# EAGLE design Breathing termo (EAGLE 9.6.2)
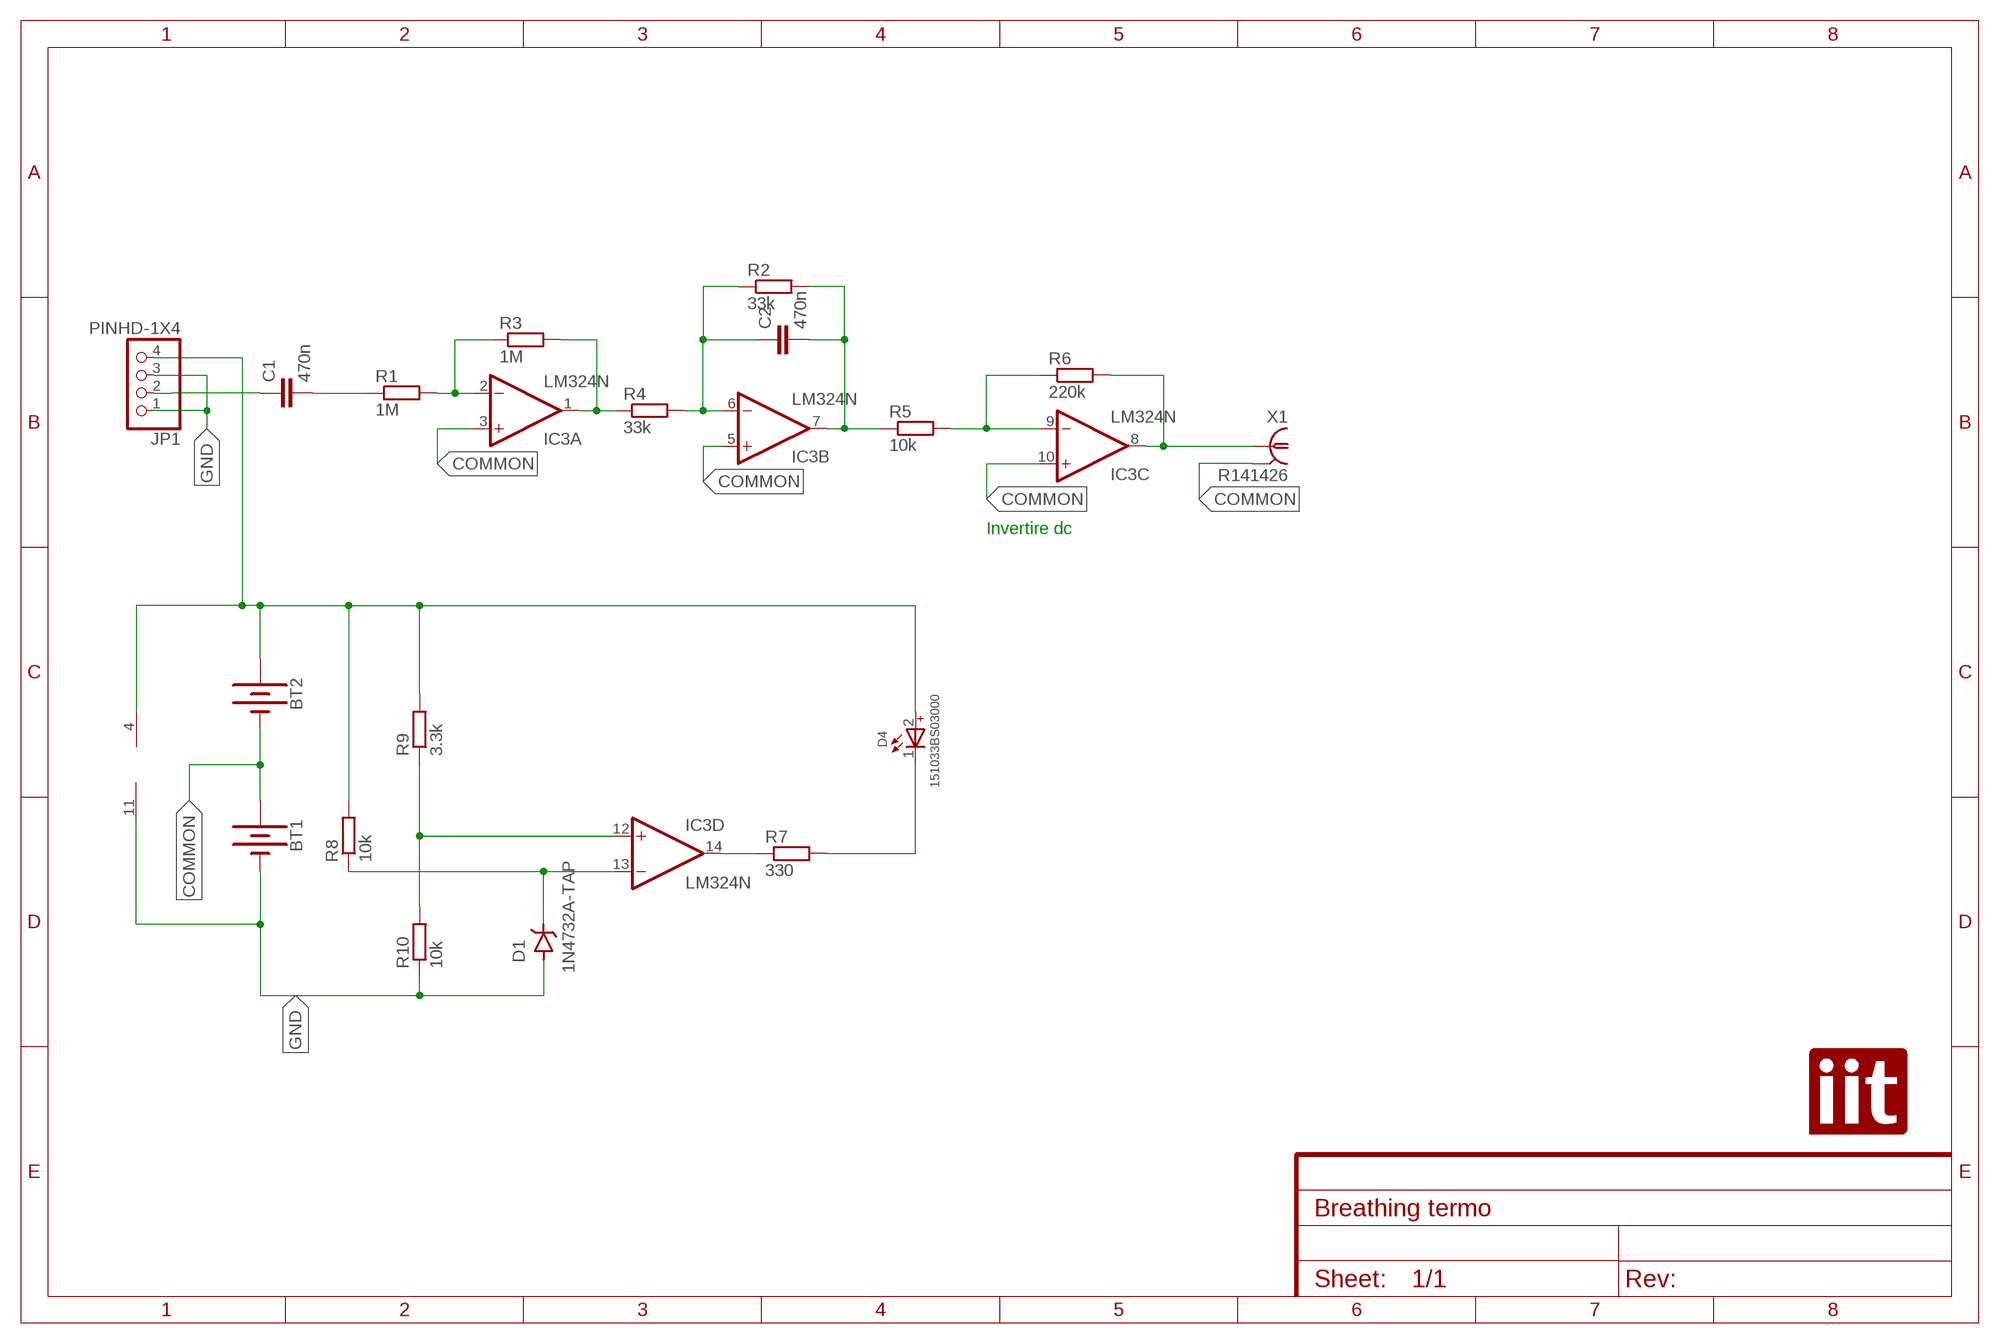
[diagram p0: schematic, sheet 1]

## Parts
BT1  BATTERY-9V  [BATTCON_9V]
BT2  BATTERY-9V  [BATTCON_9V]
C1  470n  C-EU025-025X050  [C025-025X050]
C2  470n  C-EU025-025X050  [C025-025X050]
D1  1N4732A-TAP  [DO-41]
D4  151033BS03000  WL-TMRW_3MM_151033BS03000_WITHSTOPPER  [WL-TMRW_3MM_STOPPER]
IC3  LM324N  [DIL14]
JP1  PINHD-1X4  [1X04]
R1  1M  R-EU_0204/7  [0204/7]
R2  33k  R-EU_0204/7  [0204/7]
R3  1M  R-EU_0204/7  [0204/7]
R4  33k  R-EU_0204/7  [0204/7]
R5  10k  R-EU_0204/7  [0204/7]
R6  220k  R-EU_0204/7  [0204/7]
R7  330  R-EU_0204/7  [0204/7]
R8  10k  R-EU_0204/7  [0204/7]
R9  3.3k  R-EU_0204/7  [0204/7]
R10  10k  R-EU_0204/7  [0204/7]
U$1  LOGO  [IIT]
X1  R141426  [R141426]

## Nets
COMMON: BT1.+ BT2.- IC3.3(A:+IN) IC3.5(B:+IN) IC3.10(C:+IN) X1.2 X1.3 X1.4 X1.5
GND: BT1.- D1.A IC3.11(P:V-) JP1.1 JP1.3 R10.1
N$1: C1.2 R1.1
N$2: IC3.2(A:-IN) R1.2 R3.1
N$3: IC3.1(A:OUT) R3.2 R4.1
N$4: C2.1 IC3.6(B:-IN) R2.1 R4.2
N$5: C2.2 IC3.7(B:OUT) R2.2 R5.1
N$6: IC3.9(C:-IN) R5.2 R6.1
N$7: IC3.8(C:OUT) R6.2 X1.1
N$8: IC3.12(D:+IN) R9.1 R10.2
N$9: D4.1(-) R7.2
N$10: D1.C IC3.13(D:-IN) R8.1
N$11: C1.1 JP1.2
N$12: IC3.14(D:OUT) R7.1
N$14: BT2.+ D4.2(+) IC3.4(P:V+) JP1.4 R8.2 R9.2

## Notes on the sheet
- Invertire dc

## Library data of the parts
BT1 BT2 = SparkFun-Batteries:BATTERY: Battery - Single Cell A variety of battery chemistries, sizes, and footprints. Device List: 20MM_PTH - Coin Cell Battery Holder - 20mm (PTH) <https://www.sparkfun.com/products/783> 6.8MM_PTH - Coin Cell Battery Holder - 6.8MM(SMD) <https://www.digikey.com/product-detail/en/seiko-instruments/MS621FE-FL11E/728-1057-ND/1889208?WT.srch=1&gclid=CNOQ5a6LzdQCFZS2wAodXCkE0g> 12MM_SMD - Coin Cell Battery Holder - 12mm (SMD) <https://www.sparkfun.com/products/10592> 12MM_PTH - Coin Cell Battery Holder - 12mm (PTH) <https://www.sparkfun.com/products/7948> 20MM_SMD - 20mm Coin Cell Battery Holder (SMD) (2 legs) Used on the Big Time Watch Kit <https://www.sparkfun.com/products/11734> 20MM_SMD_4LEGS - Coin Cell Battery Holder - 20mm (SMD) <https://www.sparkfun.com/products/11892> 20MM_SMD_4LEGS_OVERPASTE - Coin Cell Battery Holder - 20mm (SMD) <https://www.sparkfun.com/products/11892> (Over-paste on the legs) 24.5MM_PTH - Coin Cell Battery Holder - 24.5mm (PTH) <https://www.sparkfun.com/products/8863> 9V - 9V Battery Holder - PC Mount Used on the SparkFun SparkPunk Sound Kit <https://www.sparkfun.com/products/11177> and SparkFun SparkPunk Sequencer Kit <https://www.sparkfun.com/products/12707> 18650 - Battery Holder - 18650 (PTH) <https://www.sparkfun.com/products/13113> AA - Battery Holder - 1xAA (PTH) <https://www.sparkfun.com/products/7949> AAA - Battery Holder - 1xAAA (PTH) <https://www.sparkfun.com/products/12718> AA_KIT - Battery Holder - 1xAA (PTH) <https://www.sparkfun.com/products/7949> Special kit package - pads only have exposed copper on one side of the board. AAA_KIT - Battery Holder - 1xAAA (PTH) <https://www.sparkfun.com/products/12718> Special kit package - pads only have exposed copper on one side of the board.; PROD_ID: BATT-10855
C1 C2 = rcl:C-EU: CAPACITOR, European symbol; SPICEPREFIX: C
D1 = Diodes-2:1N4732A-TAP: DIODE ZENER 4.7V 1.3W DO41 Manufacturer's datasheet <https://www.vishay.com/docs/85816/1n4728a.pdf>; CREATED_BY: PCBLayout.com; DIGIKEY_PART_NUMBER: 1N4732A-TAPGICT-ND; MANUFACTURER: Vishay General Semiconductor - Diodes Division; MPN: 1N4732A-TAP; PACKAGE: DO-41
D4 = Wurth_LEDs_WL-TMRW:WL-TMRW_3MM: WL-TMRW THT Mono-color Round Waterclear Characteristics Low energy consumption High reliability Low current requirement Fast switching No UV/IR radiation Easy installation Ultra high luminous efficacy Versatile mounting on PC boards With and without stopper Applications Indicator light Displays Traffic signal light Marker lights Commercial outdoor advertising Energy saving lamp Backlight LED Displays Electronic and optical indicator PBC mounted panel indicator Variable message sign <https://www.we-online.com/catalog/media/o14911v209%20Family_TMRW_THT.jpg> Details see: www.we-online.com/catalog/en/WL-TMRW <www.we-online.com/catalog/WL-TMRW/?utm_source=eagle_model&utm_medium=description_link&utm_campaign=eisos_eagle> Updated by Ella 2022-06-21 2022(C) Wurth Elektronik; CHIP-TECHNOLOGY: InGaN; DATASHEET-URL: https://www.we-online.com/redexpert/spec/151033BS03000?ae; DOMINANT-WAVELENGTH: 470nm; EMITTING-COLOR: Blue; FORWARD-VOLTAGE: 2.8V; LUMINOUS-INTENSITY: 3800mcd; PART-NUMBER: 151033BS03000; PEAK-WAVELENGTH: 465nm; VIEWING-ANGLE: 30°
IC3 = linear:LM324: OP AMP
JP1 = Connector:PINHD-1X4: PIN HEADER; CATEGORY: Headers; DESCRIPTION: Header, Straight, 4 Position; MANUFACTURER: Generic; MPN: Generic; OPERATING_TEMPERATURE: Generic; PART_STATUS: Active; PITCH: 0.100" (2.54mm); ROHS_COMPLIANCE: Generic; SERIES: Generic; SUB-CATEGORY: Headers, Male Pins; TYPE: Board to Board or Cable, Unshrouded, Through Hole, Straight
R1-R10 = resistor:R-EU_: RESISTOR, European symbol
U$1 = LOGO:LOGO
X1 = con-coax:R141426: BNC COAX CONNECTOR Radiall 50/75 Ohm Spoerle; MF: FARNELL; MPN: R141426161; OC_FARNELL: 4195115; OC_NEWARK: 14J7919

## Board
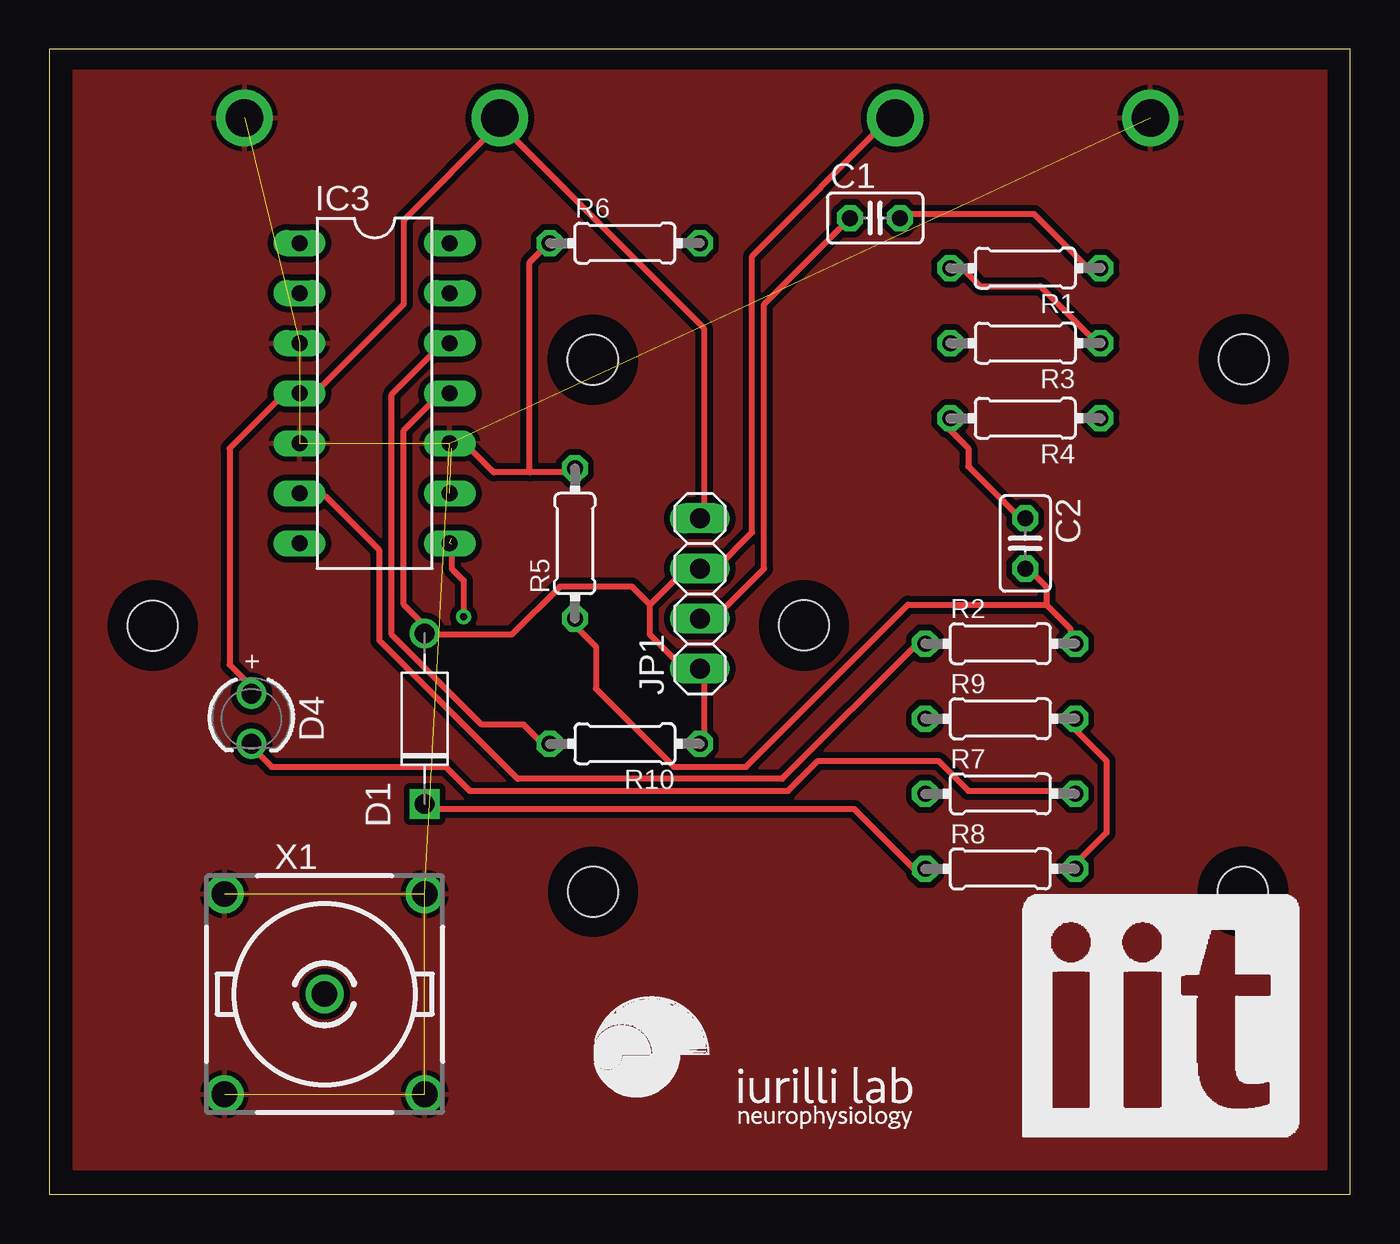
[diagram p1: board, top side]
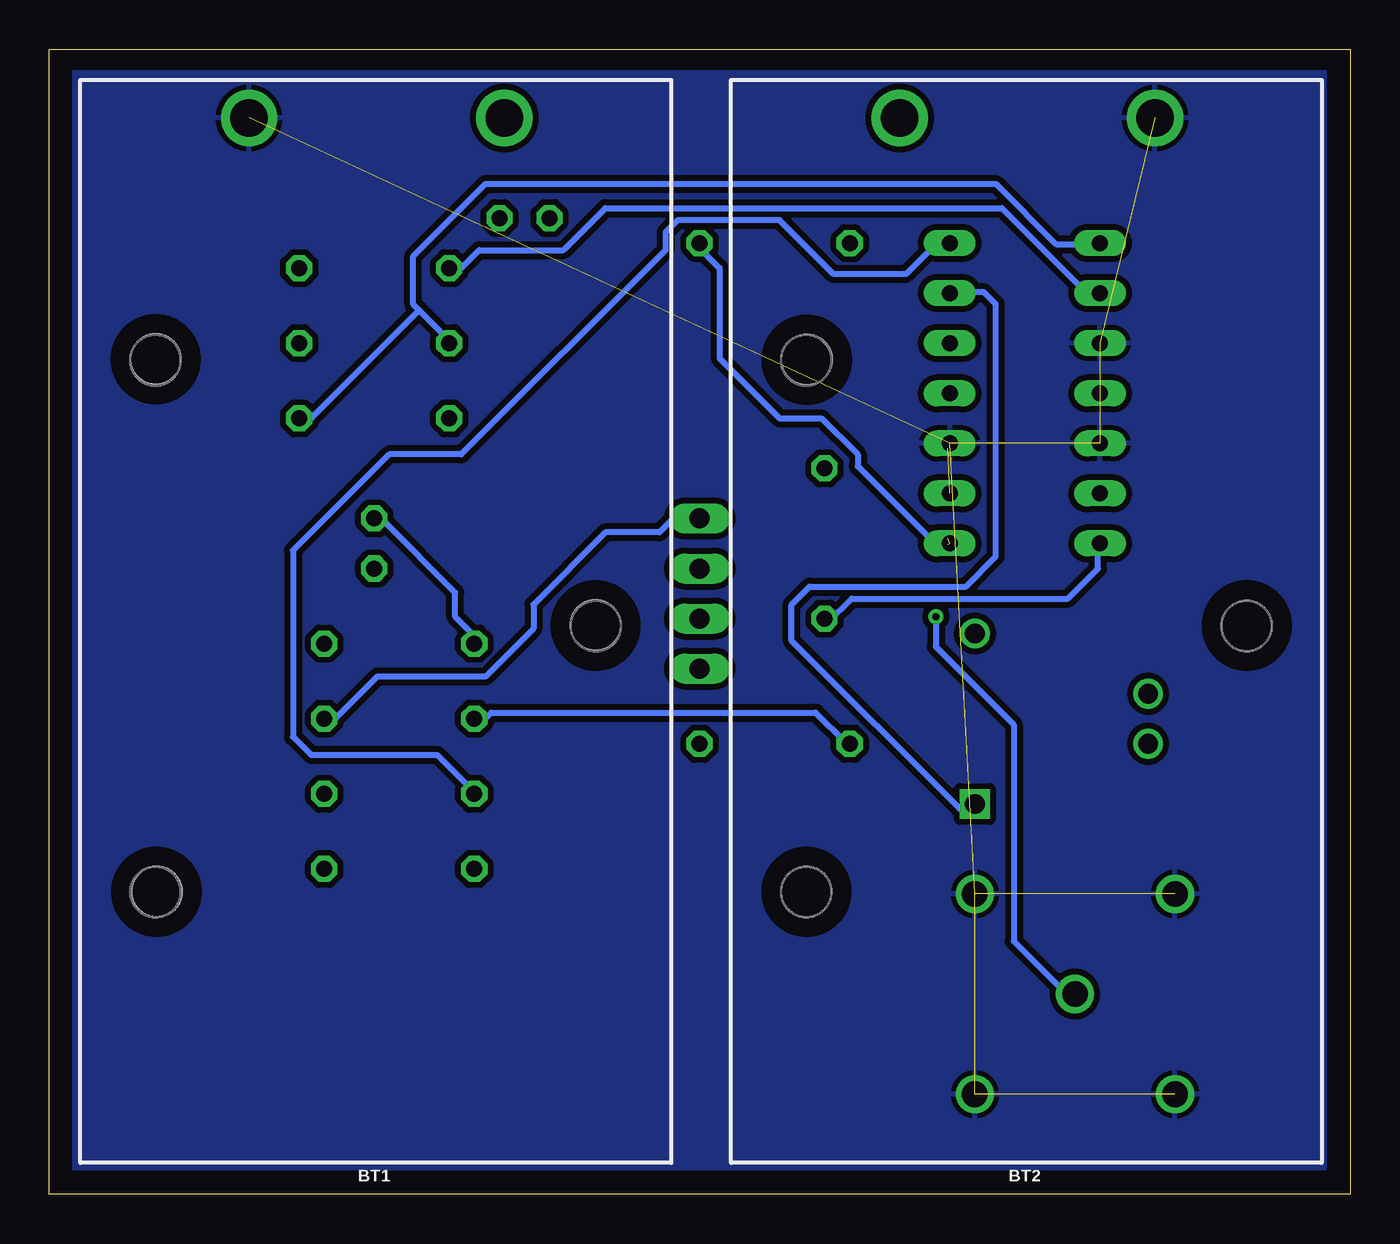
[diagram p2: board, bottom side, seen from below]

Size 66.02 x 58.09 mm. Coordinates in mm from the lower left corner, seen from the top.
Outline: 0,0 66.02,0 66.02,58.09 0,58.09 0,0
Copper layers (1*16): Top 0.035mm / dielectric 1.5mm / Bottom 0.035mm
Design rules "default *": minimum track width 12mil, minimum drill 0.35mm, track to track 12mil, track to pad 12mil, pad to pad 12mil, via to via 12mil, smd to smd 12mil, copper to edge 40mil, drill to drill 12mil, minimum pad ring 10mil, minimum via ring 8mil, stop-mask expansion 4mil, vias tented up to drill 0mil, thermal gap 10mil
Holes 2.54 mm at 5.25,28.86 27.58,42.34 27.6,15.35 60.61,42.36 38.29,28.86 60.58,15.35

### Footprints (pad centres in the part's own frame; a part is rotated, then mirrored left to right if it is on the bottom)
BATTCON_9V = drill 1.905: + 0,0; - 0,-12.954
C025-025X050 = drill 0.813 octagon: 1 -1.27,0; 2 1.27,0
DO-41 = drill 1: A 4.325,0 | drill 1 square: C -4.325,0
WL-TMRW_3MM_STOPPER = drill 1: 1 1.27,0.1; 2 -1.27,0.1
DIL14 = drill 0.813 long: 1 -7.62,-3.81; 2 -5.08,-3.81; 3 -2.54,-3.81; 4 0,-3.81; 5 2.54,-3.81; 6 5.08,-3.81; 7 7.62,-3.81; 8 7.62,3.81; 9 5.08,3.81; 10 2.54,3.81; 11 0,3.81; 12 -2.54,3.81; 13 -5.08,3.81; 14 -7.62,3.81
1X04 = drill 1.016 long: 1 -3.81,0; 2 -1.27,0; 3 1.27,0; 4 3.81,0
0204/7 = drill 0.813 octagon: 1 -3.81,0; 2 3.81,0
R141426 = drill 1.295: 1 0,0; 2 5.08,5.08; 3 -5.08,5.08; 4 -5.08,-5.08; 5 5.08,-5.08

### Placement (x,y rotation side)
BT1  55.88,54.61 90 bottom
BT2  22.86,54.61 90 bottom
C1  41.91,49.53 0 top
C2  49.53,33.02 270 top
D1  19.05,24.13 90 top
D4  10.16,24.13 270 top
IC3  16.51,40.64 270 top
JP1  33.02,30.48 90 top
R1  49.53,46.99 180 top
R2  48.26,27.94 0 top
R3  49.53,43.18 180 top
R4  49.53,39.37 180 top
R5  26.67,33.02 90 top
R6  29.21,48.26 0 top
R7  48.26,20.32 0 top
R8  48.26,16.51 0 top
R9  48.26,24.13 0 top
R10  29.21,22.86 180 top
U$1  48.26,2.54 0 top
U$2  [IURILLI]  33.02,5.08 0 top
X1  13.97,10.16 0 top

### Tracks (layer width: path | path; a pad name or v marks a point on that pad's centre or on a via)
COMMON  (8 unrouted)
  pour Top: 1.27,57.15 64.77,57.15 64.77,1.27 1.27,1.27
  pour Bottom: 1.27,57.15 1.27,1.27 64.77,1.27 64.77,57.15
GND
  Top 0.305: IC3.11 20.12,40.59 19.81,40.59 17.98,38.76 17.98,29.92 19.2,28.7 D1.A 19.2,28.4 23.47,28.4 25.91,30.84 29.57,30.84 30.48,29.92 | R10.1 33.22,22.91 33.22,26.57 JP1.1 32.92,26.87 32,26.87 30.48,28.4 30.48,29.92 | 30.48,29.92 32.31,31.75 32.92,31.75 JP1.3 33.22,31.75 33.83,31.75 35.66,33.58 35.66,47.6 42.67,54.61 BT1.-
N$1
  Top 0.305: R1.1 52.73,46.99 49.99,49.73 43.28,49.73 C1.2
N$2
  Top 0.305: R1.2 46.33,46.99 47.24,46.08 50.29,46.08 53.03,43.33 53.34,43.33 R3.1
  Bottom 0.305: R1.2 45.11,46.99 44.2,47.9 39.93,47.9 37.8,50.04 17.68,50.04 13.41,45.77 12.8,45.77 IC3.2
N$3
  Bottom 0.305: 47.24,44.86 46.02,43.64 46.02,43.33 45.72,43.03 R3.2 | 47.24,44.86 47.55,45.16 47.55,47.6 43.89,51.26 17.98,51.26 14.94,48.21 12.8,48.21 IC3.1 | R4.1 52.73,39.37 47.24,44.86
N$4
  Top 0.305: R4.2 45.72,38.76 46.63,37.85 46.63,36.93 49.07,34.49 49.38,34.49 C2.1 | IC3.6 12.8,35.41 14.02,35.41 16.76,32.66 16.76,28.09 23.77,21.08 37.19,21.08 44.2,28.09 R2.1
  Bottom 0.305: C2.1 49.38,34.19 49.07,34.19 45.41,30.53 45.41,29.31 44.2,28.09 R2.1
N$5
  Top 0.305: 50.6,29.92 51.82,28.7 51.82,28.09 R2.2 | 50.6,29.92 50.6,30.84 49.99,31.45 49.68,31.45 49.38,31.75 C2.2 | 50.6,29.92 43.59,29.92 35.36,21.69 31.7,21.69 27.74,25.65 27.74,27.79 26.52,29.01 R5.1
  Bottom 0.305: IC3.7 12.8,32.97 12.8,31.75 14.33,30.23 25.3,30.23 26.52,29.01 R5.1
N$6  (1 unrouted)
  Top 0.305: 20.42,37.85 21.34,37.85 22.55,36.63 24.38,36.63 | 24.38,36.63 26.52,36.63 R5.2 | 24.38,36.63 24.38,47.29 25.3,48.21 R6.1
N$7  (via drill 0.35)  (2 unrouted)
  Top 0.305: v21.03,29.31 21.03,31.14 20.42,31.75 20.42,32.97
  Bottom 0.305: 20.42,33.27 21.34,33.27 24.99,36.93 24.99,37.54 26.82,39.37 28.96,39.37 32,42.42 32,46.99 33.22,48.21 R6.2 | v21.03,29.31 21.03,27.79 17.07,23.82 17.07,12.85 14.63,10.41 14.02,10.41 X1.1
N$8
  Top 0.305: IC3.12 20.12,43.03 19.81,43.03 17.37,40.59 17.37,28.4 21.95,23.82 24.08,23.82 25.3,22.61 R10.2
  Bottom 0.305: R10.2 25.6,22.91 27.13,24.44 43.59,24.44 44.2,23.82 44.5,24.13 R9.1
N$9
  Top 0.305: R7.2 51.82,20.47 46.63,20.47 45.11,22 39.01,22 37.49,20.47 21.34,20.47 20.12,21.69 11.28,21.69 10.67,22.3 10.36,22.3 10.06,22.61 D4.1
N$10
  Top 0.305: R8.1 44.2,16.51 43.89,16.51 40.84,19.56 19.2,19.56 D1.C
  Bottom 0.305: IC3.13 20.12,45.77 18.59,45.77 17.98,45.16 17.98,32.36 19.51,30.84 27.43,30.84 28.35,29.92 28.35,28.09 19.81,19.56 19.2,19.56 D1.C
N$11
  Top 0.305: C1.1 40.54,49.43 36.27,45.16 36.27,31.75 33.83,29.31 33.22,29.31 JP1.2
N$12
  Bottom 0.305: R7.1 44.5,20.47 46.33,22.3 52.73,22.3 53.65,23.22 53.65,32.66 48.77,37.54 45.11,37.54 34.75,47.9 34.75,48.82 34.14,49.43 28.96,49.43 26.21,46.68 22.55,46.68 21.03,48.21 20.42,48.21 IC3.14
N$14
  Top 0.305: R8.2 52.12,16.51 52.12,16.81 53.65,18.34 53.65,22 52.12,23.52 52.12,24.13 R9.2 | 22.86,54.3 17.98,49.43 17.98,45.16 13.72,40.89 12.8,40.89 IC3.4 12.5,40.59 11.89,40.59 9.14,37.85 9.14,26.87 10.06,25.96 10.06,25.65 D4.2 | 22.86,54.3 BT2.+ 22.86,54.3 | 22.86,54.3 33.22,43.94 33.22,34.49 JP1.4
  Bottom 0.305: R9.2 51.82,24.13 51.51,24.13 49.38,26.26 43.89,26.26 41.45,28.7 41.45,29.92 37.8,33.58 35.05,33.58 34.44,34.19 33.22,34.19 JP1.4